# Altium schematic sheet DaughterBoard.SchDoc: {Наименование}
size 420 x 297 mm; DocumentNumber: ВКА.821011.000.ПЗ; PageSetup: Record=PageOptions|CenterHorizontal=False|CenterVertical=False|PrintScale=0.95|XCorrection=0.00|YCorrection=0.00|PrintKind=1|BorderSize=5000000|LeftOffset=0|BottomOffset=0|Orientation=1|PaperLength=1000|PaperWidth=1000|Scale=100|PaperSource=15|PrintQuality=600|MediaType=1|DitherType=10|PaperKind=A4|PrintScaleMode=1; Rule: PcbType=ProtelPcb
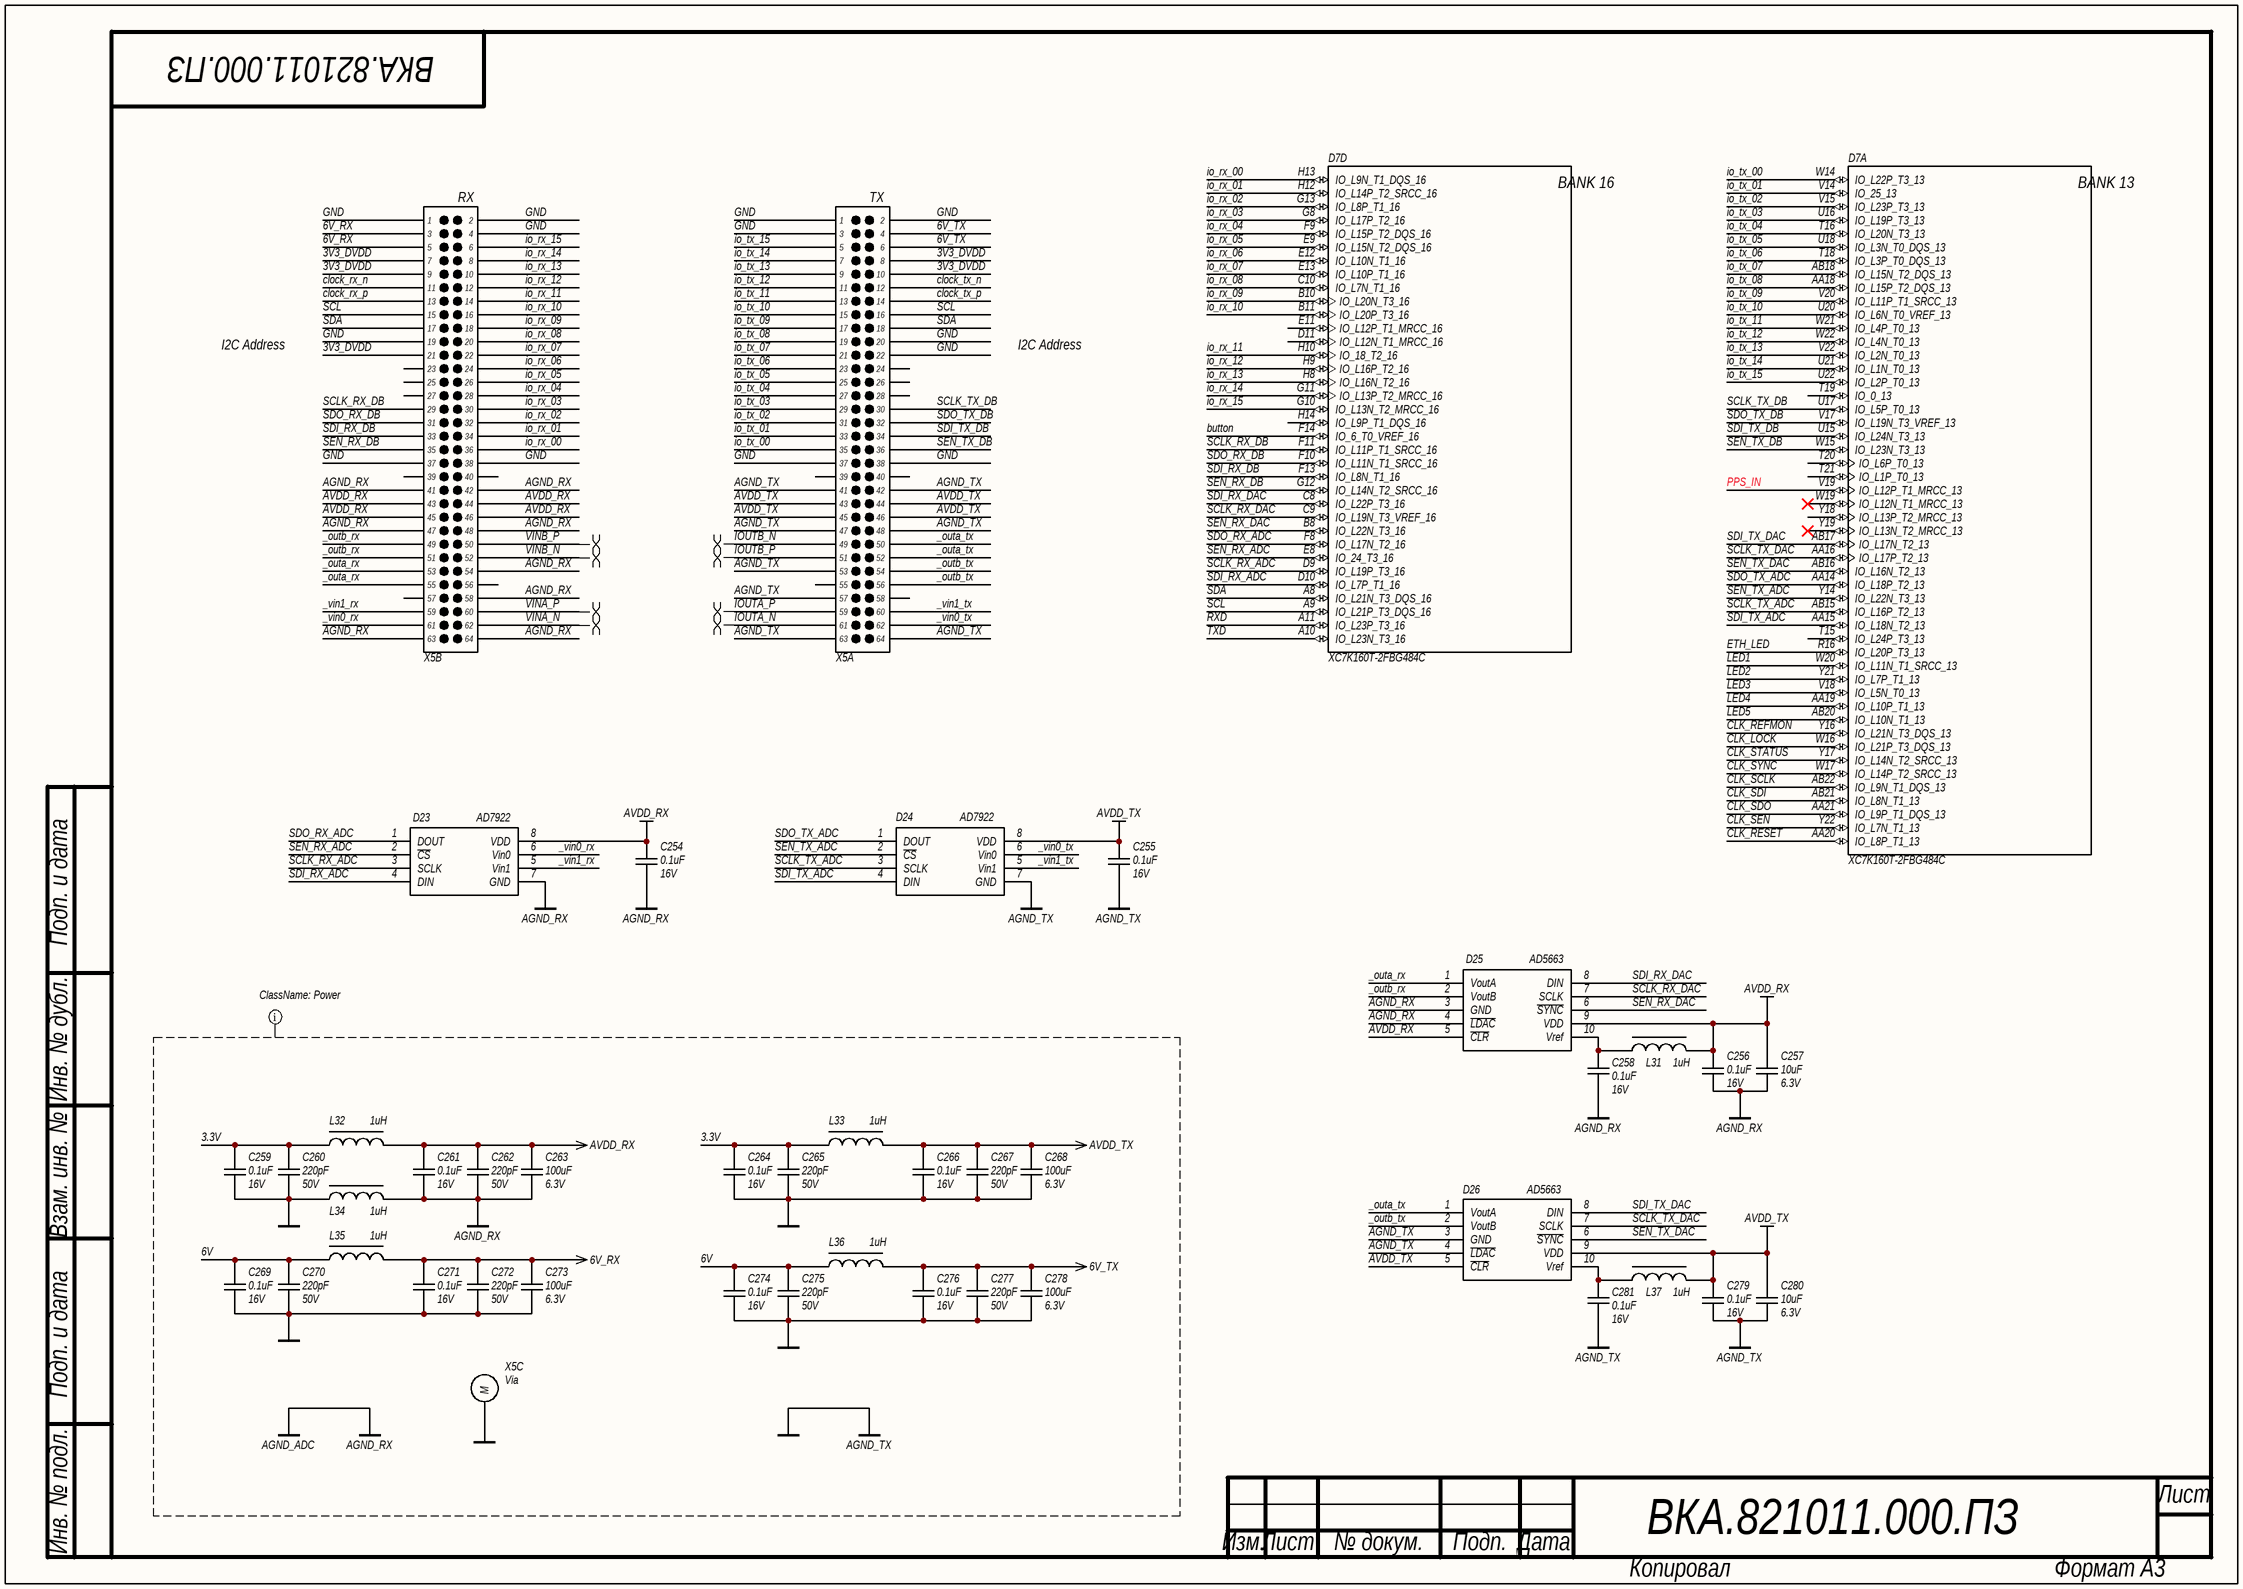
[diagram p0: DaughterBoard.SchDoc]

## Parts
C254  value 0.1uF  Voltage: 16V  [C0402]  (hidden comment: CAP)
C255  value 0.1uF  Voltage: 16V  [C0402]  (hidden comment: CAP)
C256  value 0.1uF  Voltage: 16V  [C0402]  (hidden comment: CAP)
C257  value 10uF  Voltage: 6.3V  [C0603]  (hidden comment: CAP)
C258  value 0.1uF  Voltage: 16V  [C0402]  (hidden comment: CAP)
C259  value 0.1uF  Voltage: 16V  [C0603]  (hidden comment: CAP)
C260  value 220pF  Voltage: 50V  [C0603]  (hidden comment: CAP)
C261  value 0.1uF  Voltage: 16V  [C0603]  (hidden comment: CAP)
C262  value 220pF  Voltage: 50V  [C0603]  (hidden comment: CAP)
C263  value 100uF  Voltage: 6.3V  [C1210]  (hidden comment: CAP uF)
C264  value 0.1uF  Voltage: 16V  [C0603]  (hidden comment: CAP)
C265  value 220pF  Voltage: 50V  [C0603]  (hidden comment: CAP)
C266  value 0.1uF  Voltage: 16V  [C0603]  (hidden comment: CAP)
C267  value 220pF  Voltage: 50V  [C0603]  (hidden comment: CAP)
C268  value 100uF  Voltage: 6.3V  [C1210]  (hidden comment: CAP uF)
C269  value 0.1uF  Voltage: 16V  [C0603]  (hidden comment: CAP)
C270  value 220pF  Voltage: 50V  [C0603]  (hidden comment: CAP)
C271  value 0.1uF  Voltage: 16V  [C0603]  (hidden comment: CAP)
C272  value 220pF  Voltage: 50V  [C0603]  (hidden comment: CAP)
C273  value 100uF  Voltage: 6.3V  [C1210]  (hidden comment: CAP uF)
C274  value 0.1uF  Voltage: 16V  [C0603]  (hidden comment: CAP)
C275  value 220pF  Voltage: 50V  [C0603]  (hidden comment: CAP)
C276  value 0.1uF  Voltage: 16V  [C0603]  (hidden comment: CAP)
C277  value 220pF  Voltage: 50V  [C0603]  (hidden comment: CAP)
C278  value 100uF  Voltage: 6.3V  [C1210]  (hidden comment: CAP uF)
C279  value 0.1uF  Voltage: 16V  [C0402]  (hidden comment: CAP)
C280  value 10uF  Voltage: 6.3V  [C0603]  (hidden comment: CAP)
C281  value 0.1uF  Voltage: 16V  [C0402]  (hidden comment: CAP)
D7  XC7K160T-2FBG484C  [FBG484]  (parts A,D of 12)
D23  AD7922  [MSOP-8]
D24  AD7922  [MSOP-8]
D25  AD5663  [MSOP-10]
D26  AD5663  [MSOP-10]
L31  value 1uH  [L1206_Murata]  (hidden comment: Inductor LF)
L32  value 1uH  [L1210_Murata LQH]  (hidden comment: Inductor LF)
L33  value 1uH  [L1210_Murata LQH]  (hidden comment: Inductor LF)
L34  value 1uH  [L1210_Murata LQH]  (hidden comment: Inductor LF)
L35  value 1uH  [L1210_Murata LQH]  (hidden comment: Inductor LF)
L36  value 1uH  [L1210_Murata LQH]  (hidden comment: Inductor LF)
L37  value 1uH  [L1206_Murata]  (hidden comment: Inductor LF)
X5  DBoard  [DBoard]  (value not drawn)  (parts A,B,C of 3)

## Nets
6V_RX: C271.2 C272.2 C273.2 L35.2 X5.67(3) X5.69(5)
6V_TX: C276.2 C277.2 C278.2 L36.2 X5.4 X5.6
AGND_RX: C254.1 C256.1 C257.1 C258.1 C261.1 C262.1 C263.1 D23.7(GND) D25.3(GND) D25.4(~{LDAC}) L34.2 X5.105(41) X5.106(42) X5.111(47) X5.112(48) X5.118(54) X5.122(58) X5.127(63) X5.128(64)  [also labelled AGND_ADC]
AGND_TX: C255.1 C259.1 C260.1 C264.1 C265.1 C266.1 C267.1 C268.1 C269.1 C270.1 C271.1 C272.1 C273.1 C274.1 C275.1 C276.1 C277.1 C278.1 C279.1 C280.1 C281.1 D24.7(GND) D26.3(GND) D26.4(~{LDAC}) L34.1 X5.0(M) X5.1 X5.2 X5.3 X5.20 X5.22 X5.37 X5.38 X5.41 X5.42 X5.47 X5.48 X5.53 X5.57 X5.63 X5.64 X5.65(1) X5.66(2) X5.68(4) X5.83(19) X5.101(37) X5.102(38)  [also labelled GND]
AVDD_RX: C254.2 C256.2 C257.2 C261.2 C262.2 C263.2 D23.8(VDD) D25.5(~{CLR}) D25.9(VDD) L31.2 L32.2 X5.107(43) X5.108(44) X5.109(45) X5.110(46)
AVDD_TX: C255.2 C266.2 C267.2 C268.2 C279.2 C280.2 D24.8(VDD) D26.5(~{CLR}) D26.9(VDD) L33.2 L37.2 X5.43 X5.44 X5.45 X5.46
3.3V: C259.2 C260.2 C264.2 C265.2 L32.1 L33.1
3V3_DVDD: X5.8 X5.10 X5.71(7) X5.73(9) X5.85(21)
6V: C269.2 C270.2 C274.2 C275.2 L35.1 L36.1
_outa_rx: D25.1(VoutA) X5.117(53) X5.119(55)
_outa_tx: D26.1(VoutA) X5.50 X5.52
_outb_rx: D25.2(VoutB) X5.113(49) X5.115(51)
_outb_tx: D26.2(VoutB) X5.54 X5.56
_vin0_rx: D23.6(Vin0) X5.125(61)
_vin0_tx: D24.6(Vin0) X5.62
_vin1_rx: D23.5(Vin1) X5.123(59)
_vin1_tx: D24.5(Vin1) X5.60
button: D7.F14(IO_6_T0_VREF_16)
CLK_LOCK: D7.W16(IO_L21P_T3_DQS_13)
CLK_REFMON: D7.Y16(IO_L21N_T3_DQS_13)
CLK_RESET: D7.AA20(IO_L8P_T1_13)
CLK_SCLK: D7.AB22(IO_L9N_T1_DQS_13)
CLK_SDI: D7.AB21(IO_L8N_T1_13)
CLK_SDO: D7.AA21(IO_L9P_T1_DQS_13)
CLK_SEN: D7.Y22(IO_L7N_T1_13)
CLK_STATUS: D7.Y17(IO_L14N_T2_SRCC_13)
CLK_SYNC: D7.W17(IO_L14P_T2_SRCC_13)
clock_rx_n: X5.75(11)
clock_rx_p: X5.77(13)
clock_tx_n: X5.12
clock_tx_p: X5.14
ETH_LED: D7.R16(IO_L20P_T3_13)
io_rx_00: D7.H13(IO_L9N_T1_DQS_16) X5.100(36)
io_rx_01: D7.H12(IO_L14P_T2_SRCC_16) X5.98(34)
io_rx_02: D7.G13(IO_L8P_T1_16) X5.96(32)
io_rx_03: D7.G8(IO_L17P_T2_16) X5.94(30)
io_rx_04: D7.F9(IO_L15P_T2_DQS_16) X5.92(28)
io_rx_05: D7.E9(IO_L15N_T2_DQS_16) X5.90(26)
io_rx_06: D7.E12(IO_L10N_T1_16) X5.88(24)
io_rx_07: D7.E13(IO_L10P_T1_16) X5.86(22)
io_rx_08: D7.C10(IO_L7N_T1_16) X5.84(20)
io_rx_09: D7.B10(IO_L20N_T3_16) X5.82(18)
io_rx_10: D7.B11(IO_L20P_T3_16) X5.80(16)
io_rx_11: D7.H10(IO_18_T2_16) X5.78(14)
io_rx_12: D7.H9(IO_L16P_T2_16) X5.76(12)
io_rx_13: D7.H8(IO_L16N_T2_16) X5.74(10)
io_rx_14: D7.G11(IO_L13P_T2_MRCC_16) X5.72(8)
io_rx_15: D7.G10(IO_L13N_T2_MRCC_16) X5.70(6)
io_tx_00: D7.W14(IO_L22P_T3_13) X5.35
io_tx_01: D7.V14(IO_25_13) X5.33
io_tx_02: D7.V15(IO_L23P_T3_13) X5.31
io_tx_03: D7.U16(IO_L19P_T3_13) X5.29
io_tx_04: D7.T16(IO_L20N_T3_13) X5.27
io_tx_05: D7.U18(IO_L3N_T0_DQS_13) X5.25
io_tx_06: D7.T18(IO_L3P_T0_DQS_13) X5.23
io_tx_07: D7.AB18(IO_L15N_T2_DQS_13) X5.21
io_tx_08: D7.AA18(IO_L15P_T2_DQS_13) X5.19
io_tx_09: D7.V20(IO_L11P_T1_SRCC_13) X5.17
io_tx_10: D7.U20(IO_L6N_T0_VREF_13) X5.15
io_tx_11: D7.W21(IO_L4P_T0_13) X5.13
io_tx_12: D7.W22(IO_L4N_T0_13) X5.11
io_tx_13: D7.V22(IO_L2N_T0_13) X5.9
io_tx_14: D7.U21(IO_L1N_T0_13) X5.7
io_tx_15: D7.U22(IO_L2P_T0_13) X5.5
IOUTA_N: X5.61
IOUTA_P: X5.59
IOUTB_N: X5.49
IOUTB_P: X5.51
LED1: D7.W20(IO_L11N_T1_SRCC_13)
LED2: D7.Y21(IO_L7P_T1_13)
LED3: D7.V18(IO_L5N_T0_13)
LED4: D7.AA19(IO_L10P_T1_13)
LED5: D7.AB20(IO_L10N_T1_13)
PPS_IN: D7.V19(IO_L12P_T1_MRCC_13)
RXD: D7.A11(IO_L23P_T3_16)
SCL: D7.A9(IO_L21P_T3_DQS_16) X5.16 X5.79(15)
SCLK_RX_ADC: D7.D9(IO_L19P_T3_16) D23.3(SCLK)
SCLK_RX_DAC: D7.C9(IO_L19N_T3_VREF_16) D25.7(SCLK)
SCLK_RX_DB: D7.F11(IO_L11P_T1_SRCC_16) X5.93(29)
SCLK_TX_ADC: D7.AB15(IO_L16P_T2_13) D24.3(SCLK)
SCLK_TX_DAC: D7.AA16(IO_L17P_T2_13) D26.7(SCLK)
SCLK_TX_DB: D7.U17(IO_L5P_T0_13) X5.30
SDA: D7.A8(IO_L21N_T3_DQS_16) X5.18 X5.81(17)
SDI_RX_ADC: D7.D10(IO_L7P_T1_16) D23.4(DIN)
SDI_RX_DAC: D7.C8(IO_L22P_T3_16) D25.8(DIN)
SDI_RX_DB: D7.F13(IO_L8N_T1_16) X5.97(33)
SDI_TX_ADC: D7.AA15(IO_L18N_T2_13) D24.4(DIN)
SDI_TX_DAC: D7.AB17(IO_L17N_T2_13) D26.8(DIN)
SDI_TX_DB: D7.U15(IO_L24N_T3_13) X5.34
SDO_RX_ADC: D7.F8(IO_L17N_T2_16) D23.1(DOUT)
SDO_RX_DB: D7.F10(IO_L11N_T1_SRCC_16) X5.95(31)
SDO_TX_ADC: D7.AA14(IO_L18P_T2_13) D24.1(DOUT)
SDO_TX_DB: D7.V17(IO_L19N_T3_VREF_13) X5.32
SEN_RX_ADC: D7.E8(IO_24_T3_16) D23.2(~{CS})
SEN_RX_DAC: D7.B8(IO_L22N_T3_16) D25.6(~{SYNC})
SEN_RX_DB: D7.G12(IO_L14N_T2_SRCC_16) X5.99(35)
SEN_TX_ADC: D7.Y14(IO_L22N_T3_13) D24.2(~{CS})
SEN_TX_DAC: D7.AB16(IO_L16N_T2_13) D26.6(~{SYNC})
SEN_TX_DB: D7.W15(IO_L23N_T3_13) X5.36
TXD: D7.A10(IO_L23N_T3_16)
VINA_N: X5.126(62)
VINA_P: X5.124(60)
VINB_N: X5.116(52)
VINB_P: X5.114(50)
NetC258_2: C258.2 D25.10(Vref) L31.1
NetC281_2: C281.2 D26.10(Vref) L37.1

Not connected (* = marked no-connect by the designer): D7 D11(IO_L12N_T1_MRCC_16) E11(IO_L12P_T1_MRCC_16) H14(IO_L9P_T1_DQS_16) T15(IO_L24P_T3_13) T19(IO_0_13) T20(IO_L6P_T0_13) T21(IO_L1P_T0_13) W19(IO_L12N_T1_MRCC_13)* Y18(IO_L13P_T2_MRCC_13) Y19(IO_L13N_T2_MRCC_13)*; X5 24 26 28 39 40 55 58 87(23) 89(25) 91(27) 103(39) 104(40) 120(56) 121(57)

## Layout directives
net class Power: 3.3V, 6V, 6V_RX, 6V_TX, AGND_ADC, AGND_RX, AGND_TX, AVDD_RX, AVDD_TX, GND
differential pair: IOUTA_N, IOUTA_P, IOUTB_N, IOUTB_P, VINA_N, VINA_P, VINB_N, VINB_P

## Notes on the sheet
- I2C Address
- Подп. и дата
- Инв. № дубл.
- Взам. инв. №
- Инв. № подл.
- Лист
- Изм.
- № докум.
- Подп.
- Дата
- Копировал
- Формат А3
- (in symbol DBoard, part A) TX
- (in symbol DBoard, part B) RX
- (in symbol XC7K160T-2FBG484C, part A) BANK 13
- (in symbol XC7K160T-2FBG484C, part D) BANK 16

## Library data of the parts
C254-C256 C258 C279 C281 = CAP: SMD Capacitor; Manufacturer: Murata; Material: X7R; Tolerance: 10%; Type: Ceramic Capacitor; P/N: GRM155R71C104KA88J
C257 C280 = CAP: SMD Capacitor; Manufacturer: Murata; Material: X7R; Tolerance: 10%; Type: Ceramic Capacitor; P/N: GRM188R60J106ME47J
C259 C261 C264 C266 C269 C271 C274 C276 = CAP: SMD Capacitor; Manufacturer: Murata; Material: X7R; Tolerance: 10%; Type: Ceramic Capacitor; P/N: GRM188R71C104KA01D
C260 C262 C265 C267 C270 C272 C275 C277 = CAP: SMD Capacitor; Manufacturer: Murata; Material: X7R; Tolerance: 10%; Type: Ceramic Capacitor; P/N: GRM188R71H221KA01D
C263 C268 C273 C278 = CAP uF: SMD Capacitor; Manufacturer: Murata; Material: X5R; Tolerance: 20%; Type: Ceramic Capacitor; P/N: GRM32ER60J107ME20L
D7 = XC7K160T-2FBG484C: Xilinx 7-Series FPGA; Speed Grade: -2; Manufacturer: Xilinx; Name: XC7K160T-2FBG484C; Series: 7-Series FPGA; Package: 484 Ball FBG
D23 D24 = AD79x2: 1 MSPS, 10-/12-Bit ADC; Manufacturer: Analog Device; Fast throughput rate: 1MHz; High speed serial interface: SPI®/QSPI™/MICROWIRE™/DSP compatible; Name: AD7922ARM; Type: 2-Channel, 2.35 V to 5.25 V,1 MSPS, 10-/12-Bit ADC; Voltage: 2.35 V to 5.25 V; Package: MSOP-8
D25 D26 = AD56x3R: Dual 12-/14-/16-Bit nanoDAC; Manufacturer: Analog Device; High speed serial interface: SPI®/QSPI™/MICROWIRE™/DSP compatibl; Name: AD5663RBRMZ-5; settling time: 4.5 μs maximum; Type: Dual 12-/14-/16-Bit nanoDAC with 5 ppm/°C On-Chip Reference; Voltage: 2.7 V to 5.5 V; Package: MSOP-10
L31 L37 = Inductor LF: Inductor Power Lines; Manufacturer: Murata; Name: LQM31PN1R0M00; Current: 2500mA; Tolerance: 5%; Frequency: 100MHz; Temperature Range: -25ºC to 85ºC; Series: LQM; P/N: LQM31PN1R0M00
L32-L36 = Inductor LF: Inductor Power Lines; Manufacturer: Murata; Name: LQH32PN1R0NNC; Current: 2500mA; Tolerance: 5%; Frequency: 100MHz; Temperature Range: -25ºC to 85ºC; Series: LQH; P/N: LQH32PN1R0NNC
X5 = DBoard: USRP DBoard; Name: 1.00mm Pitch Mezzanine 714362164